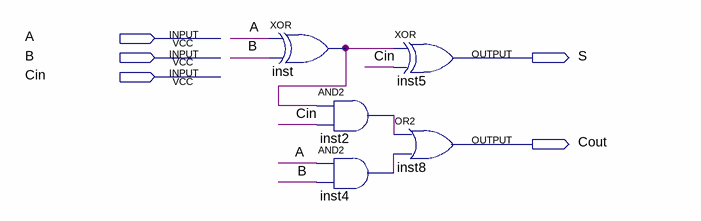
[diagram p0: schematic sheet]
// Quartus schematic fullAdder.bdf as structural Verilog: 5 symbols, 5 pins
module fullAdder (
  input  A,
  input  B,
  input  Cin,
  output S,
  output Cout
);

  wire inst2_out, inst4_out, inst_out;

  xor inst (inst_out, A, B);
  and inst2 (inst2_out, inst_out, Cin);
  and inst4 (inst4_out, A, B);
  xor inst5 (S, inst_out, Cin);
  or inst8 (Cout, inst2_out, inst4_out);
endmodule
